# EAGLE design PolluxSensorTemp (EAGLE 6.1)
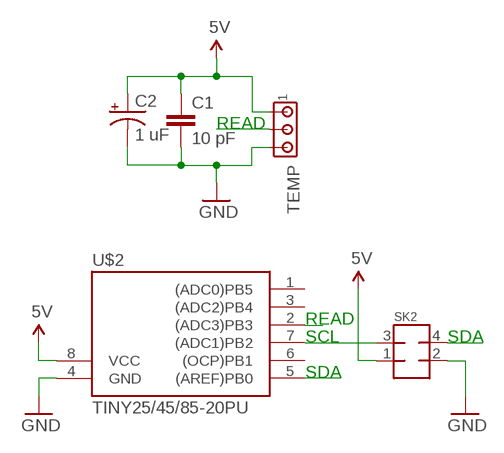
[diagram p0: schematic, sheet 1]

## Parts
C1  10 pF  CAPPTH1  [CAP-PTH-5MM]
C2  1 uF  CAP_POLPTH2  [CPOL-RADIAL-10UF-25V]
SK2  MMATCH-8-PTH  [AMP-215079-8]
TEMP  MTA03-100  [10X03MTA]
U$2  TINY25/45/85-20PU  [DIL08]

## Nets
5V: C1.1 C2.1(+) SK2.1 TEMP.1 U$2.8(VCC)
GND: C1.2 C2.2(-) SK2.2 TEMP.3 U$2.4(GND)
N$1: SK2.3 U$2.7((ADC1)PB2)
READ: TEMP.2 U$2.2((ADC3)PB3)
SDA: SK2.4 U$2.5((AREF)PB0)
Unconnected: U$2.1((ADC0)PB5) U$2.3((ADC2)PB4) U$2.6((OCP)PB1)

## Notes on the sheet
- READ
- READ
- SCL | SDA
- SDA

## Library data of the parts
C1 = SparkFun:CAP: Capacitor Standard 0603 ceramic capacitor, and 0.1" leaded capacitor.
C2 = SparkFun:CAP_POL: Capacitor Polarized These are standard SMD and PTH capacitors. Normally 10uF, 47uF, and 100uF in electrolytic and tantalum varieties. Always verify the external diameter of the through hole cap, it varies with capacity, voltage, and manufacturer. The EIA devices should be standard.
SK2 = jt-con-micromatch:MMATCH-8-*: AMP Micromatch 8-pin
TEMP = con-amp:MTA03-100: AMP connector
U$2 = avr-7:TINY25/45/85

## Board
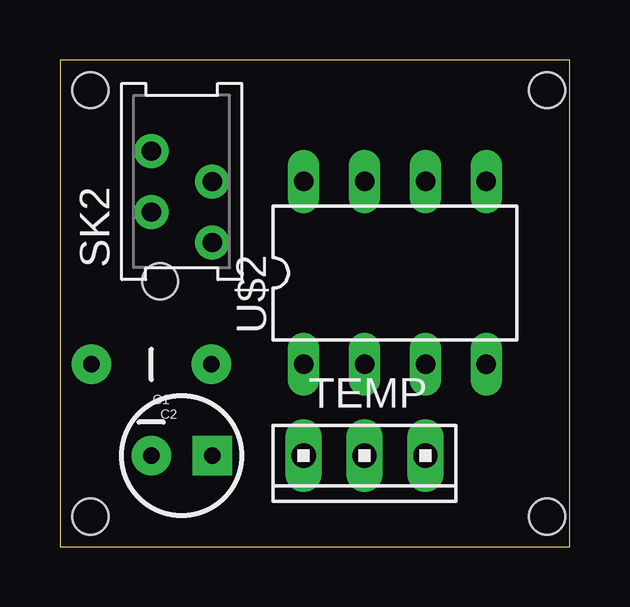
[diagram p1: board, top side]
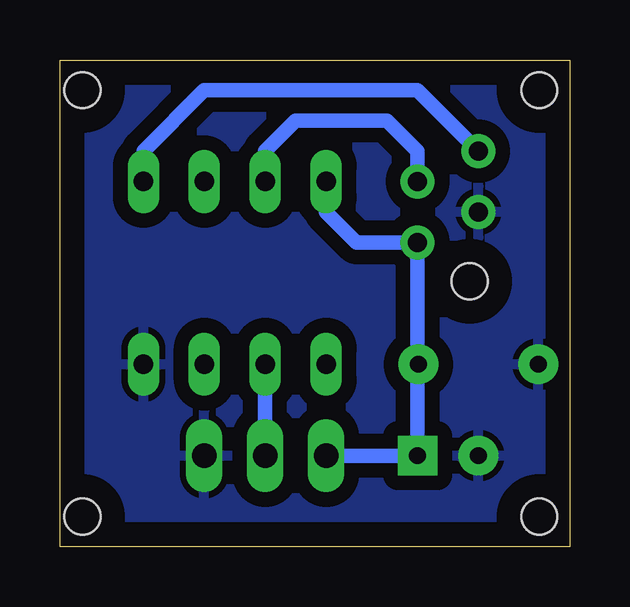
[diagram p2: board, bottom side, seen from below]

Size 21.26 x 20.31 mm. Coordinates in mm from the lower left corner, seen from the top.
Outline: 0,0 21.26,0 21.26,20.31 0,20.31 0,0
Copper layers (1*16): Top 0.035mm / dielectric 1.5mm / Bottom 0.035mm
Design rules: minimum track width 24mil, minimum drill 24mil, track to track 24mil, track to pad 24mil, pad to pad 8mil, via to via 8mil, smd to smd 8mil, copper to edge 40mil, drill to drill 8mil, minimum pad ring 10mil, minimum via ring 8mil, stop-mask expansion 4mil, vias tented up to drill 0mil, thermal gap 10mil
Holes 1.5 mm at 1.27,19.05 1.27,1.27 20.32,1.27 20.32,19.05

### Footprints (pad centres in the part's own frame; a part is rotated, then mirrored left to right if it is on the bottom)
CAP-PTH-5MM = drill 0.7 pad 1.651: 1 -2.5,0; 2 2.5,0
CPOL-RADIAL-10UF-25V = drill 0.7 pad 1.651 square: 1 1.27,0 | drill 0.7 pad 1.651: 2 -1.27,0
AMP-215079-8 = drill 0.8 pad 1.422: 1 0,-1.27; 2 1.27,1.27; 3 2.54,-1.27; 4 3.81,1.27 | hole 1.5: -1.62,0.905
10X03MTA = drill 1.016 long: 1 2.54,0; 2 0,0; 3 -2.54,0
DIL08 = drill 0.813 long: 1 -3.81,-3.81; 2 -1.27,-3.81; 3 1.27,-3.81; 4 3.81,-3.81; 5 3.81,3.81; 6 1.27,3.81; 7 -1.27,3.81; 8 -3.81,3.81

### Placement (x,y rotation side)
C1  3.81,7.62 180 top
C2  5.08,3.81 0 top
SK2  5.08,12.7 90 top
TEMP  12.7,3.81 180 top
U$2  13.97,11.43 0 top

### Tracks (layer width: path | path; a pad name or v marks a point on that pad's centre or on a via)
5V
  Bottom 0.61: U$2.8 10.16,13.97 8.89,12.7 SK2.1 6.35,7.62 | 6.35,7.62 C1.1 | 6.35,7.62 C2.1 TEMP.1
GND
  pour Bottom: 0,20.32 21.59,20.32 21.59,0 0,0
N$1
  Bottom 0.61: SK2.3 6.35,16.51 7.62,17.78 11.43,17.78 12.7,16.51 U$2.7
READ
  Bottom 0.61: TEMP.2 U$2.2
SDA
  Bottom 0.61: SK2.4 6.35,19.05 15.24,19.05 17.78,16.51 U$2.5